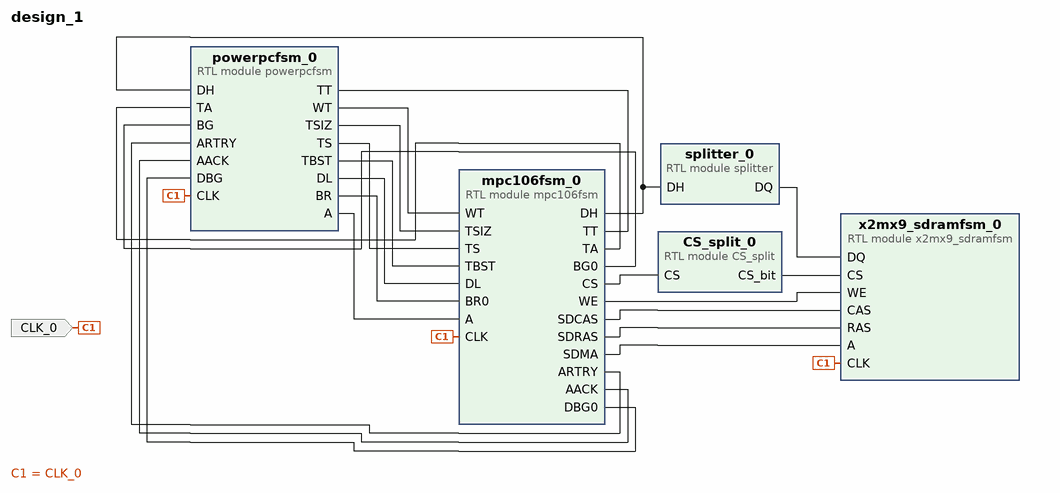
[diagram p0: block diagram of the top level]
# Vivado block design design_1, xc7z020clg484-1, Vivado 2019.2.1
create_bd_design design_1

create_bd_port -dir I -type clk CLK_0

create_bd_cell -type module -reference splitter splitter_0
create_bd_cell -type module -reference CS_split CS_split_0
create_bd_cell -type module -reference x2mx9_sdramfsm x2mx9_sdramfsm_0
create_bd_cell -type module -reference powerpcfsm powerpcfsm_0
create_bd_cell -type module -reference mpc106fsm mpc106fsm_0

# ---- connections ----

connect_bd_net -net CLK_0_1 [get_bd_ports CLK_0] [get_bd_pins x2mx9_sdramfsm_0/CLK] [get_bd_pins powerpcfsm_0/CLK] [get_bd_pins mpc106fsm_0/CLK]
connect_bd_net [get_bd_pins mpc106fsm_0/WE] [get_bd_pins x2mx9_sdramfsm_0/WE]
connect_bd_net [get_bd_pins powerpcfsm_0/WT] [get_bd_pins mpc106fsm_0/WT]
connect_bd_net [get_bd_pins mpc106fsm_0/TA] [get_bd_pins powerpcfsm_0/TA]
connect_bd_net [get_bd_pins powerpcfsm_0/TSIZ] [get_bd_pins mpc106fsm_0/TSIZ]
connect_bd_net [get_bd_pins powerpcfsm_0/TS] [get_bd_pins mpc106fsm_0/TS]
connect_bd_net [get_bd_pins mpc106fsm_0/DH] [get_bd_pins splitter_0/DH] [get_bd_pins powerpcfsm_0/DH]
connect_bd_net [get_bd_pins mpc106fsm_0/SDCAS] [get_bd_pins x2mx9_sdramfsm_0/CAS]
connect_bd_net [get_bd_pins mpc106fsm_0/SDRAS] [get_bd_pins x2mx9_sdramfsm_0/RAS]
connect_bd_net [get_bd_pins mpc106fsm_0/SDMA] [get_bd_pins x2mx9_sdramfsm_0/A]
connect_bd_net [get_bd_pins powerpcfsm_0/TT] [get_bd_pins mpc106fsm_0/TT]
connect_bd_net [get_bd_pins splitter_0/DQ] [get_bd_pins x2mx9_sdramfsm_0/DQ]
connect_bd_net [get_bd_pins CS_split_0/CS_bit] [get_bd_pins x2mx9_sdramfsm_0/CS]
connect_bd_net [get_bd_pins powerpcfsm_0/TBST] [get_bd_pins mpc106fsm_0/TBST]
connect_bd_net [get_bd_pins powerpcfsm_0/DL] [get_bd_pins mpc106fsm_0/DL]
connect_bd_net [get_bd_pins powerpcfsm_0/BR] [get_bd_pins mpc106fsm_0/BR0]
connect_bd_net [get_bd_pins mpc106fsm_0/BG0] [get_bd_pins powerpcfsm_0/BG]
connect_bd_net [get_bd_pins mpc106fsm_0/ARTRY] [get_bd_pins powerpcfsm_0/ARTRY]
connect_bd_net [get_bd_pins mpc106fsm_0/AACK] [get_bd_pins powerpcfsm_0/AACK]
connect_bd_net [get_bd_pins mpc106fsm_0/DBG0] [get_bd_pins powerpcfsm_0/DBG]
connect_bd_net [get_bd_pins mpc106fsm_0/CS] [get_bd_pins CS_split_0/CS]
connect_bd_net [get_bd_pins powerpcfsm_0/A] [get_bd_pins mpc106fsm_0/A]

validate_bd_design
save_bd_design
